# Altium schematic sheet TDisplay.SchDoc: LiveDesign Evaluation - Alarm Clock
size A3; Organization: Altium Limited; Address1: L3, 12a Rodborough Rd; Address2: Frenchs Forest; Address3: NSW; Address4: Australia 2086; DocumentNumber: 2; SheetNumber: 2; SheetTotal: 10
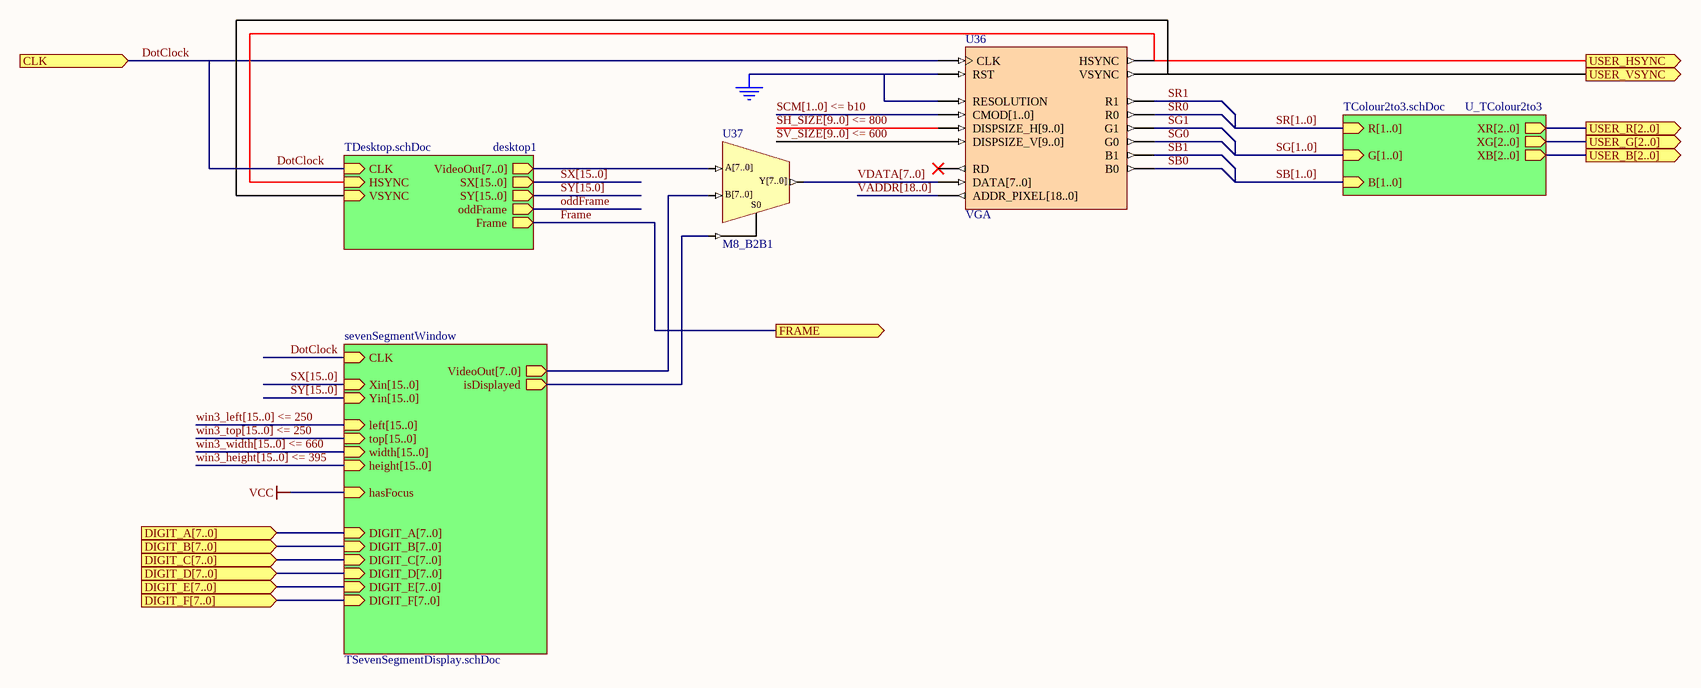
[diagram p0: TDisplay.SchDoc]

## Parts
U36  VGA
U37  M8_B2B1

## Sub-sheets
desktop1 = TDesktop.schDoc: CLK (in), VideoOut[7..0] (out), SX[15..0] (out), SY[15..0] (out), HSYNC (in), VSYNC (in), Frame (out), oddFrame (out)
sevenSegmentWindow = TSevenSegmentDisplay.schDoc: CLK (in), VideoOut[7..0] (out), Xin[15..0] (in), Yin[15..0] (in), top[15..0] (in), width[15..0] (in), height[15..0] (in), left[15..0] (in), DIGIT_A[7..0] (in), isDisplayed (out), hasFocus (in), DIGIT_B[7..0] (in), DIGIT_C[7..0] (in), DIGIT_D[7..0] (in), DIGIT_E[7..0] (in), DIGIT_F[7..0] (in)
U_TColour2to3 = TColour2to3.schDoc: XR[2..0] (out), XG[2..0] (out), XB[2..0] (out), R[1..0] (in), G[1..0] (in), B[1..0] (in)

## Ports
CLK (in), DIGIT_A[7..0] (in), DIGIT_B[7..0] (in), DIGIT_C[7..0] (in), DIGIT_D[7..0] (in), DIGIT_E[7..0] (in), DIGIT_F[7..0] (in), FRAME (out), USER_B[2..0] (out), USER_G[2..0] (out), USER_HSYNC (out), USER_R[2..0] (out), USER_VSYNC (out)

## Nets
GND: U36.RESOLUTION U36.RST
VCC: sheet sevenSegmentWindow/hasFocus
DotClock: U36.CLK ; port CLK, sheet sevenSegmentWindow/CLK, sheet desktop1/CLK
Frame: port FRAME, sheet desktop1/Frame
oddFrame: sheet desktop1/oddFrame
SB0: U36.B0
SB1: U36.B1
SCM[1..0] <= b10: U36.CMOD[1..0]
SG0: U36.G0
SG1: U36.G1
SH_SIZE[9..0] <= 800: U36.DISPSIZE_H[9..0]
SR0: U36.R0
SR1: U36.R1
SV_SIZE[9..0] <= 600: U36.DISPSIZE_V[9..0]
USER_HSYNC: U36.HSYNC ; port USER_HSYNC, sheet desktop1/HSYNC
USER_VSYNC: U36.VSYNC ; port USER_VSYNC, sheet desktop1/VSYNC
VADDR[18..0]: U36.ADDR_PIXEL[18..0]
VDATA[7..0]: U36.DATA[7..0] U37.Y[7..0]
NetU37_A[7..0]: U37.A[7..0] ; sheet desktop1/VideoOut[7..0]
NetU37_B[7..0]: U37.B[7..0] ; sheet sevenSegmentWindow/VideoOut[7..0]
NetU37_S0: U37.S0 ; sheet sevenSegmentWindow/isDisplayed

Not connected (* = marked no-connect by the designer): U36 RD*

## Buses and harness runs
bus port DIGIT_A[7..0] = sheet sevenSegmentWindow/DIGIT_A[7..0]
bus port DIGIT_B[7..0] = sheet sevenSegmentWindow/DIGIT_B[7..0]
bus port DIGIT_C[7..0] = sheet sevenSegmentWindow/DIGIT_C[7..0]
bus port DIGIT_D[7..0] = sheet sevenSegmentWindow/DIGIT_D[7..0]
bus port DIGIT_E[7..0] = sheet sevenSegmentWindow/DIGIT_E[7..0]
bus port DIGIT_F[7..0] = sheet sevenSegmentWindow/DIGIT_F[7..0]
bus port USER_B[2..0] = sheet U_TColour2to3/XB[2..0]
bus port USER_G[2..0] = sheet U_TColour2to3/XG[2..0]
bus port USER_R[2..0] = sheet U_TColour2to3/XR[2..0]
bus SB[1..0] = sheet U_TColour2to3/B[1..0]
bus SCM[1..0] <= b10
bus SG[1..0] = sheet U_TColour2to3/G[1..0]
bus SH_SIZE[9..0] <= 800
bus SR[1..0] = sheet U_TColour2to3/R[1..0]
bus SV_SIZE[9..0] <= 600
bus SX[15..0] = sheet desktop1/SX[15..0]
bus SX[15..0] = sheet sevenSegmentWindow/Xin[15..0]
bus SY[15.0] = sheet desktop1/SY[15..0]
bus SY[15..0] = sheet sevenSegmentWindow/Yin[15..0]
bus VADDR[18..0]
bus VDATA[7..0]
bus win3_height[15..0] <= 395 = sheet sevenSegmentWindow/height[15..0]
bus win3_left[15..0] <= 250 = sheet sevenSegmentWindow/left[15..0]
bus win3_top[15..0] <= 250 = sheet sevenSegmentWindow/top[15..0]
bus win3_width[15..0] <= 660 = sheet sevenSegmentWindow/width[15..0]

## Notes on the sheet
- Title
- Size:
- Date:
- A3
- Number:
- Time:
- Revision:
- Sheet
- of
- File:

## Library data of the parts
U36 = VGA: VGA Controller; Published: 18/12/2003; Publisher: Altium Hobart Technology Centre; Core Revision: 1.00.00
U37 = M8_B2B1: 2x8-Bit Bus to 1x8-Bit Bus Multiplexer; ArchiveName: GENERIC; VHDLIB_SIM: GENERIC_LIB; Published: 29-Jan-2004; Publisher: Altium Limited; Core Revision: 1.00.00